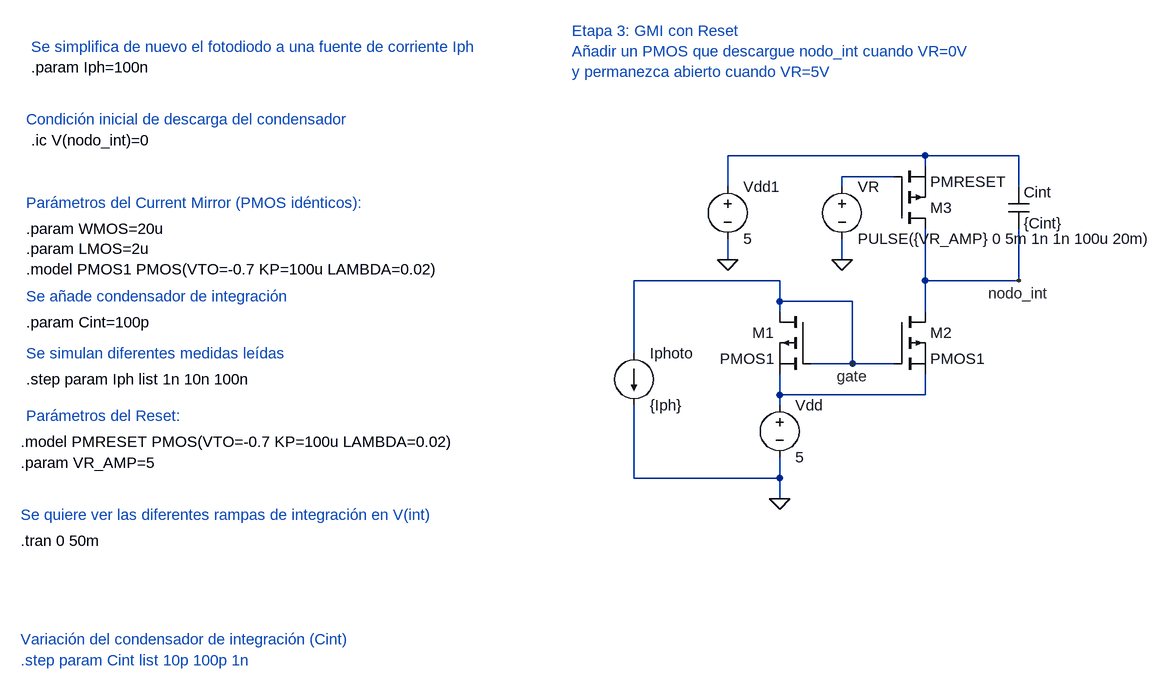
[diagram p0: schematic GMI_Etapa3_test.asc]
GMI_Etapa3_test.asc, the LTspice schematic file:
Version 4.1
SHEET 1 1144 1072
WIRE 608 272 304 272
WIRE 752 272 608 272
WIRE 608 288 608 272
WIRE 560 304 480 304
WIRE 304 320 304 272
WIRE 480 320 480 304
WIRE 752 320 752 272
WIRE 304 432 304 400
WIRE 480 432 480 400
WIRE 384 464 160 464
WIRE 608 464 608 384
WIRE 752 464 752 384
WIRE 752 464 608 464
WIRE 384 496 384 464
WIRE 496 496 384 496
WIRE 384 512 384 496
WIRE 608 512 608 464
WIRE 160 576 160 464
WIRE 496 592 496 496
WIRE 496 592 432 592
WIRE 560 592 496 592
WIRE 384 640 384 608
WIRE 608 640 608 608
WIRE 608 640 384 640
WIRE 384 656 384 640
WIRE 160 768 160 656
WIRE 384 768 384 736
WIRE 384 768 160 768
WIRE 384 800 384 768
FLAG 384 800 0
FLAG 752 464 nodo_int
FLAG 496 592 gate
FLAG 480 432 0
FLAG 304 432 0
SYMBOL voltage 384 640 R0
WINDOW 123 0 0 Left 0
WINDOW 39 0 0 Left 0
SYMATTR InstName Vdd
SYMATTR Value 5
SYMBOL current 160 576 R0
SYMATTR InstName Iphoto
SYMATTR Value {Iph}
SYMBOL cap 736 320 R0
SYMATTR InstName Cint
SYMATTR Value {Cint}
SYMBOL pmos 560 512 R0
SYMATTR InstName M2
SYMATTR Value PMOS1
SYMATTR SpiceLine L={LMOS} W={WMOS}
SYMBOL pmos 432 512 M0
SYMATTR InstName M1
SYMATTR Value PMOS1
SYMATTR SpiceLine L={LMOS} W={WMOS}
SYMBOL pmos 560 384 M180
SYMATTR InstName M3
SYMATTR Value PMRESET
SYMATTR SpiceLine L={LMOS} W={WMOS}
SYMBOL voltage 480 304 R0
SYMATTR InstName VR
SYMATTR Value PULSE({VR_AMP} 0 5m 1n 1n 100u 20m)
SYMBOL voltage 304 304 R0
WINDOW 123 0 0 Left 0
WINDOW 39 0 0 Left 0
SYMATTR InstName Vdd1
SYMATTR Value 5
TEXT 64 80 Left 2 ;Etapa 3: GMI con Reset\nAñadir un PMOS que descargue nodo_int cuando VR=0V \ny permanezca abierto cuando VR=5V
TEXT -776 384 Left 2 !.param WMOS=20u\n.param LMOS=2u\n.model PMOS1 PMOS(VTO=-0.7 KP=100u LAMBDA=0.02)
TEXT -776 616 Left 2 !.step param Iph list 1n 10n 100n
TEXT -776 344 Left 2 ;Parámetros del Current Mirror (PMOS idénticos):
TEXT -768 104 Left 2 ;Se simplifica de nuevo el fotodiodo a una fuente de corriente Iph
TEXT -768 136 Left 2 !.param Iph=100n
TEXT -776 576 Left 2 ;Se simulan diferentes medidas leídas
TEXT -784 864 Left 2 !.tran 0 50m
TEXT -776 488 Left 2 ;Se añade condensador de integración
TEXT -776 528 Left 2 !.param Cint=100p
TEXT -784 824 Left 2 ;Se quiere ver las diferentes rampas de integración en V(int)
TEXT -768 248 Left 2 !.ic V(nodo_int)=0
TEXT -776 216 Left 2 ;Condición inicial de descarga del condensador
TEXT -776 672 Left 2 ;Parámetros del Reset:
TEXT -784 712 Left 2 !.model PMRESET PMOS(VTO=-0.7 KP=100u LAMBDA=0.02)
TEXT -784 744 Left 2 !.param VR_AMP=5
TEXT -784 1016 Left 2 ;Variación del condensador de integración (Cint)
TEXT -784 1048 Left 2 ;.step param Cint list 10p 100p 1n

The netlist it stands for:
* GMI_Etapa3_test.asc
Vdd N003 0 5
Iphoto gate 0 {Iph}
Cint N001 nodo_int {Cint}
M2 nodo_int gate N003 N003 PMOS1 L={LMOS} W={WMOS}
M1 gate gate N003 N003 PMOS1 L={LMOS} W={WMOS}
M3 nodo_int N002 N001 N001 PMRESET L={LMOS} W={WMOS}
VR N002 0 PULSE({VR_AMP} 0 5m 1n 1n 100u 20m)
Vdd1 N001 0 5
.model NMOS NMOS
.model PMOS PMOS
.lib standard.mos
* Etapa 3: GMI con Reset
* Añadir un PMOS que descargue nodo_int cuando VR=0V
* y permanezca abierto cuando VR=5V
.param WMOS=20u
.param LMOS=2u
.model PMOS1 PMOS(VTO=-0.7 KP=100u LAMBDA=0.02)
.step param Iph list 1n 10n 100n
* Parámetros del Current Mirror (PMOS idénticos):
* Se simplifica de nuevo el fotodiodo a una fuente de corriente Iph
.param Iph=100n
* Se simulan diferentes medidas leídas
.tran 0 50m
* Se añade condensador de integración
.param Cint=100p
* Se quiere ver las diferentes rampas de integración en V(int)
.ic V(nodo_int)=0
* Condición inicial de descarga del condensador
* Parámetros del Reset:
.model PMRESET PMOS(VTO=-0.7 KP=100u LAMBDA=0.02)
.param VR_AMP=5
* Variación del condensador de integración (Cint)
* .step param Cint list 10p 100p 1n
.backanno
.end